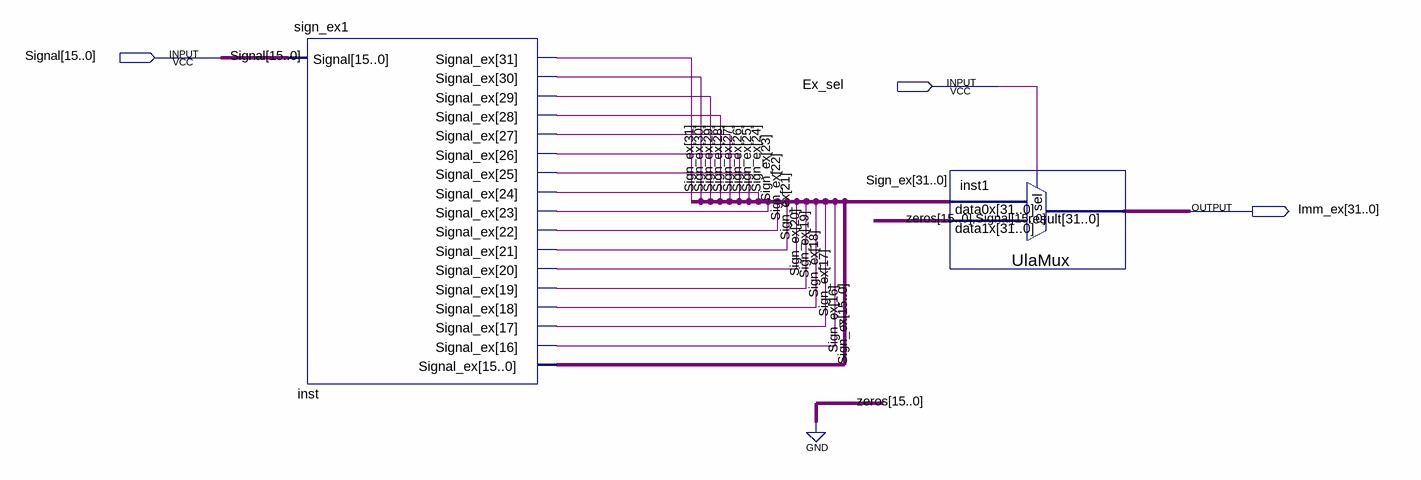
[diagram p0: schematic sheet]
// Quartus schematic signal_extended.bdf as structural Verilog: 2 symbols, 3 pins
module signal_extended (
  input  [15:0] Signal,
  input  Ex_sel,
  output [31:0] Imm_ex
);

  wire [31:0] Sign_ex;

  sign_ex1 inst (.Signal(Signal), .Signal_ex(Sign_ex));
  UlaMux inst1 (.data1x({{16{1'b0}}, Signal}), .data0x(Sign_ex), .sel(Ex_sel), .result(Imm_ex));
endmodule
